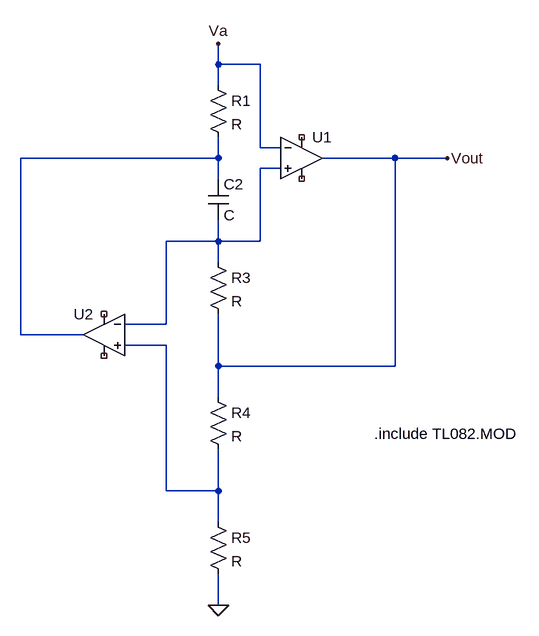
[diagram p0: schematic simulacion_parte1_TP3.asc]
simulacion_parte1_TP3.asc, the LTspice schematic file:
Version 4
SHEET 1 880 836
WIRE 192 -16 192 -48
WIRE 256 -16 192 -16
WIRE 192 16 192 -16
WIRE 256 112 256 -16
WIRE 288 112 256 112
WIRE 192 128 192 96
WIRE 192 128 -112 128
WIRE 464 128 352 128
WIRE 544 128 464 128
WIRE 288 144 256 144
WIRE 192 160 192 128
WIRE 192 256 192 224
WIRE 192 256 112 256
WIRE 256 256 256 144
WIRE 256 256 192 256
WIRE 192 288 192 256
WIRE 112 384 112 256
WIRE 112 384 48 384
WIRE -112 400 -112 128
WIRE -16 400 -112 400
WIRE 112 416 48 416
WIRE 192 448 192 368
WIRE 464 448 464 128
WIRE 464 448 192 448
WIRE 192 496 192 448
WIRE 112 640 112 416
WIRE 192 640 192 576
WIRE 192 640 112 640
WIRE 192 688 192 640
WIRE 192 816 192 768
FLAG 192 816 0
FLAG 544 128 Vout
FLAG 192 -48 Va
SYMBOL Opamps\\UniversalOpamp2 320 128 R0
SYMATTR InstName U1
SYMBOL Opamps\\UniversalOpamp2 16 400 M0
SYMATTR InstName U2
SYMBOL res 176 0 R0
SYMATTR InstName R1
SYMBOL cap 176 160 R0
SYMATTR InstName C2
SYMBOL res 176 272 R0
SYMATTR InstName R3
SYMBOL res 176 480 R0
SYMATTR InstName R4
SYMBOL res 176 672 R0
SYMATTR InstName R5
TEXT 432 552 Left 2 !.include TL082.MOD

The netlist it stands for:
* simulacion_parte1_TP3.asc
XU1 N002 Va NC_01 NC_02 Vout level.2 Avol=1Meg GBW=10Meg Slew=10Meg ilimit=25m rail=0 Vos=0 phimargin=45 en=0 enk=0 in=0 ink=0 Rin=500Meg  ; pins IN+ IN- V+ V- OUT
XU2 N003 N002 NC_03 NC_04 N001 level.2 Avol=1Meg GBW=10Meg Slew=10Meg ilimit=25m rail=0 Vos=0 phimargin=45 en=0 enk=0 in=0 ink=0 Rin=500Meg  ; pins IN+ IN- V+ V- OUT
R1 Va N001 R
C2 N001 N002 C
R3 N002 Vout R
R4 Vout N003 R
R5 N003 0 R
.include TL082.MOD
.lib UniversalOpamps2.sub
.backanno
.end